# Altium schematic sheet Supply 12V to 5V-7805 smd.SchDoc
size A
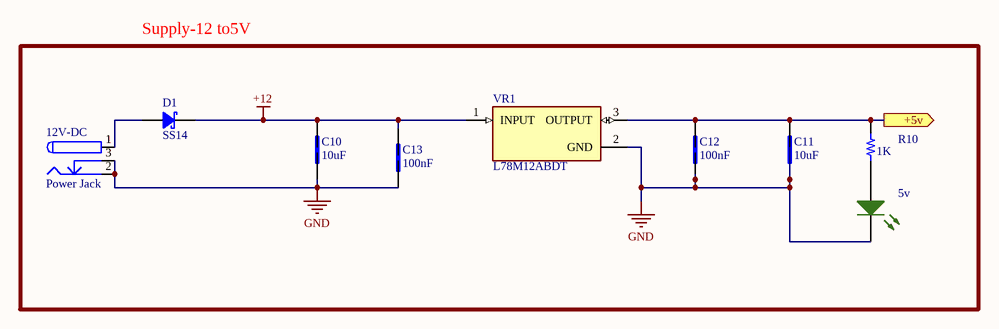
[diagram p0: Supply 12V to 5V-7805 smd.SchDoc]

## Parts
5v  LED SMD 0805 GREEN  [LED_0805_GREEN]  (value not drawn)
12V-DC  Power Jack  [DC005]
C10  10uF  [CAP 0805_2012]
C11  10uF  [CAP 0805_2012]
C12  100nF  [CAP 0805_2012]
C13  100nF  [CAP 0805_2012]
D1  SS14  [DO-214AC SMA]
R10  1K  [RES 0805_2012]
VR1  L78M12ABDT  [VREG_L78M12ABDT]

## Blocks framed on the sheet
Supply-12 to5V: 5v 12V-DC C10-C13 D1 R10 VR1

## Ports
+5v (out)

## Nets
+12: C10.2 C13.2 D1.2 VR1.1(INPUT)
GND: 5v.2(K) 12V-DC.2 12V-DC.3 C10.1 C11.1 C12.1 C13.1 VR1.2(GND)
+5v: C11.2 C12.2 R10.1 VR1.3(OUTPUT) ; port +5v
Net5v_1: 5v.1(A) R10.2
Net12V-DC_1: 12V-DC.1 D1.1

## Library data of the parts
12V-DC = Power Jack: PartNumber: DC005-5.5MM
C10-C13 = LD051C182KAB2A: COMMERCIAL CHIP STD JAPAN BULK - FN TAPE/REEL, 7 INCH PAPER TAPE-0805; Package: None; Price: None; Value: *; MP: LD051C182KAB2A; Availability: Unavailable
D1 = SS14 (SMD SMA): Diode Schottky 40V 1A Surface Mount SMA (DO-214AC); PartNumber: SS14
R10 = Res 0805: SMT Resistor; VALUE: 1K
VR1 = L78M12ABDT: Linear Voltage Regulator IC Positive Fixed 1 Output 500mA DPAK; MF: STMicroelectronics; Package: TO-252 STMicroelectronics; Price: None; Value: *; SnapEDA_Link: https://www.snapeda.com/parts/L78M12ABDT/STMicroelectronics/view-part/?ref=snap; MP: L78M12ABDT; Availability: Not in stock; Check_prices: https://www.snapeda.com/parts/L78M12ABDT/STMicroelectronics/view-part/?ref=eda